# Altium project Trap_PCB_V3.3.PrjPcb
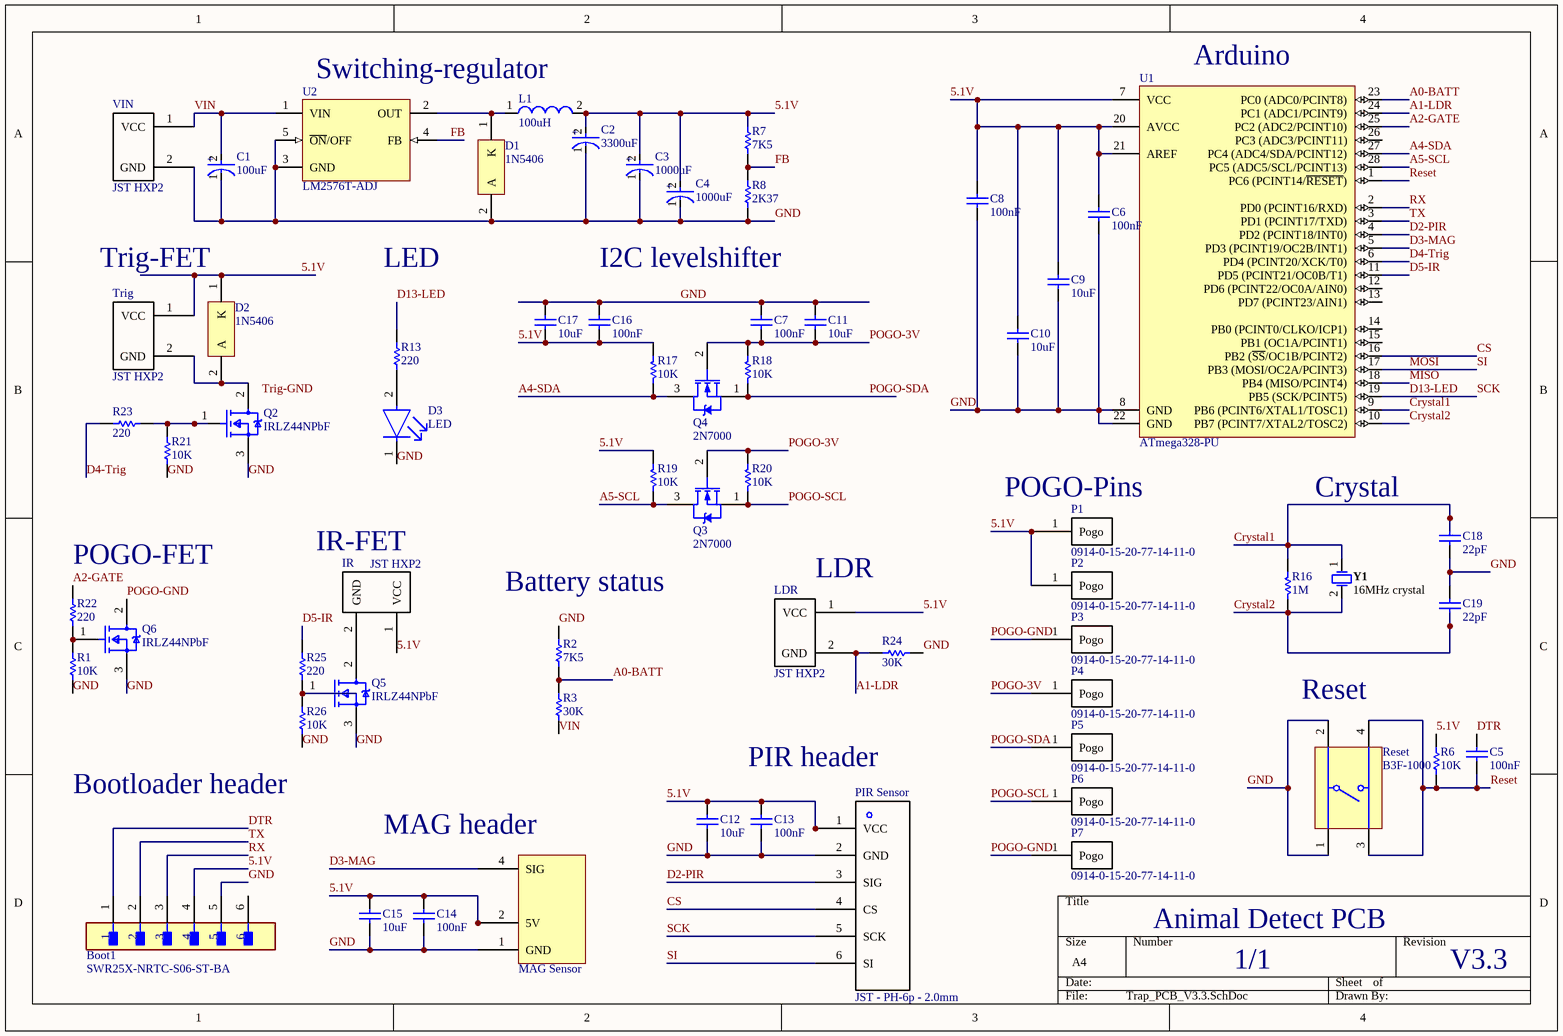
[diagram p0: Trap_PCB_V3.3.SchDoc]
1 sheet, 64 parts. Net scope: global (net labels, ports and power ports of the same name join across sheets).
Board file: Trap_PCB_V3.3.pcbdoc

## Sheet Trap_PCB_V3.3.SchDoc
size A4; SheetNumber: 1; SheetTotal: 1

### Parts
*?  MAG Sensor  [MAG]
Boot1  SWR25X-NRTC-S06-ST-BA  [FP-SWR25X-NRTC-S06-ST-BA-MFG]
C1  100uF  [FP-EEU-FR1H101B-MFG]
C2  3300uF  [FP-RAD-TH-D_10_0_5-L_12_5-MFG]
C3  1000uF  [FP-RAD-TH-D_10_0_5-L_12_5-MFG]
C4  1000uF  [FP-RAD-TH-D_10_0_5-L_12_5-MFG]
C5  100nF  [KEMT-C315-THT-2]
C6  100nF  [KEMT-C315-THT-2]
C7  100nF  [KEMT-C315-THT-2]
C8  100nF  [KEMT-C315-THT-2]
C9  10uF  [KEMT-C315-THT-2]
C10  10uF  [KEMT-C315-THT-2]
C11  10uF  [KEMT-C315-THT-2]
C12  10uF  [KEMT-C315-THT-2]
C13  100nF  [KEMT-C315-THT-2]
C14  100nF  [KEMT-C315-THT-2]
C15  10uF  [KEMT-C315-THT-2]
C16  100nF  [KEMT-C315-THT-2]
C17  10uF  [KEMT-C315-THT-2]
C18  22pF  [KEMT-C315-THT-2]
C19  22pF  [KEMT-C315-THT-2]
D1  1N5406  [ONSC-AXIAL_LEAD-2-267-05_V]
D2  1N5406  [ONSC-AXIAL_LEAD-2-267-05_V]
D3  LED  [FP-HLMP-1719-MFG]
IR  JST HXP2  [JST_XHP2_ThroughHole]
L1  100uH  [WE-TI-LB]
LDR  JST HXP2  [JST_XHP2_ThroughHole]
P1  0914-0-15-20-77-14-11-0  [0914-0-15-20-77-14-11-0]
P2  0914-0-15-20-77-14-11-0  [0914-0-15-20-77-14-11-0]
P3  0914-0-15-20-77-14-11-0  [0914-0-15-20-77-14-11-0]
P4  0914-0-15-20-77-14-11-0  [0914-0-15-20-77-14-11-0]
P5  0914-0-15-20-77-14-11-0  [0914-0-15-20-77-14-11-0]
P6  0914-0-15-20-77-14-11-0  [0914-0-15-20-77-14-11-0]
P7  0914-0-15-20-77-14-11-0  [0914-0-15-20-77-14-11-0]
PIR_Sensor  JST - PH-6p - 2.0mm  [PIR]
Q2  IRLZ44NPbF  [FP-PG-TO220-3-MFG]
Q3  2N7000  [ONSC-TO-92-3-29-11]
Q4  2N7000  [ONSC-TO-92-3-29-11]
Q5  IRLZ44NPbF  [FP-PG-TO220-3-MFG]
Q6  IRLZ44NPbF  [FP-PG-TO220-3-MFG]
R1  10K  [OMTE-RES7X2.5-2]
R2  7K5  [OMTE-RES7X2.5-2]
R3  30K  [OMTE-RES7X2.5-2]
R6  10K  [OMTE-RES7X2.5-2]
R7  7K5  [OMTE-RES7X2.5-2]
R8  2K37  [OMTE-RES7X2.5-2]
R13  220  [OMTE-RES7X2.5-2]
R16  1M  [OMTE-RES7X2.5-2]
R17  10K  [OMTE-RES7X2.5-2]
R18  10K  [OMTE-RES7X2.5-2]
R19  10K  [OMTE-RES7X2.5-2]
R20  10K  [OMTE-RES7X2.5-2]
R21  10K  [OMTE-RES7X2.5-2]
R22  220  [OMTE-RES7X2.5-2]
R23  220  [OMTE-RES7X2.5-2]
R24  30K  [OMTE-RES7X2.5-2]
R25  220  [OMTE-RES7X2.5-2]
R26  10K  [OMTE-RES7X2.5-2]
Reset  B3F-1000  [OMRON-B3F-1000-4_V]
Trig  JST HXP2  [JST_XHP2_ThroughHole]
U1  ATmega328-PU  [28P3]
U2  LM2576T-ADJ  [KC0005A]
VIN  JST HXP2  [JST_XHP2_ThroughHole]
Y1  16MHz crystal  [FOX-FOXSLF160-20]

### Nets
5.1V: *?.2(5V) Boot1.4 C2.2(A) C3.2(A) C4.2(A) C6.2 C8.2 C9.2 C10.2 C12.2 C13.2 C14.2 C15.2 C16.1 C17.1 D2.1(K) IR.1(VCC) L1.2 LDR.1(VCC) P1.1(Pogo) P2.1(Pogo) PIR_Sensor.1(VCC) R6.1 R7.2 R17.2 R19.2 Trig.1(VCC) U1.7(VCC) U1.20(AVCC) U1.21(AREF)
A0-BATT: R2.1 R3.2 U1.23(PC0_(ADC0/PCINT8))
A1-LDR: LDR.2(GND) R24.2 U1.24(PC1_(ADC1/PCINT9))
A2-GATE: R22.2 U1.25(PC2_(ADC2/PCINT10))
A4-SDA: Q4.3(D) R17.1 U1.27(PC4_(ADC4/SDA/PCINT12))
A5-SCL: Q3.3(D) R19.1 U1.28(PC5_(ADC5/SCL/PCINT13))
Crystal1: C18.2 R16.2 U1.9(PB6_(PCINT6/XTAL1/TOSC1)) Y1.1
Crystal2: C19.1 R16.1 U1.10(PB7_(PCINT7/XTAL2/TOSC2)) Y1.2
CS: PIR_Sensor.4(CS) U1.16(PB2_(~{SS}/OC1B/PCINT2))
D2-PIR: PIR_Sensor.3(SIG) U1.4(PD2_(PCINT18/INT0))
D3-MAG: *?.4(SIG) U1.5(PD3_(PCINT19/OC2B/INT1))
D4-Trig: R23.2 U1.6(PD4_(PCINT20/XCK/T0))
D5-IR: R25.2 U1.11(PD5_(PCINT21/OC0B/T1))
D13-LED: PIR_Sensor.5(SCK) R13.2 U1.19(PB5_(SCK/PCINT5))  [also labelled SCK]
DTR: Boot1.1 C5.2
FB: R7.1 R8.2 U2.4(FB)
GND: *?.1(GND) Boot1.5 C1.1(C) C2.1(C) C3.1(C) C4.1(C) C6.1 C7.2 C8.1 C9.1 C10.1 C11.2 C12.1 C13.1 C14.1 C15.1 C16.2 C17.2 C18.1 C19.2 D1.2(A) D3.1(C) PIR_Sensor.2(GND) Q2.3(S) Q5.3(S) Q6.3(S) R1.1 R2.2 R8.1 R21.1 R24.1 R26.1 Reset.1 Reset.2 U1.8(GND) U1.22(GND) U2.3(GND) U2.5(~{ON}/OFF) VIN.2(GND)
MISO: U1.18(PB4_(MISO/PCINT4))
MOSI: PIR_Sensor.6(SI) U1.17(PB3_(MOSI/OC2A/PCINT3))  [also labelled SI]
POGO-3V: C7.1 C11.1 P4.1(Pogo) Q3.2(G) Q4.2(G) R18.2 R20.2
POGO-GND: P3.1(Pogo) P7.1(Pogo) Q6.2(D)
POGO-SCL: P6.1(Pogo) Q3.1(S) R20.1
POGO-SDA: P5.1(Pogo) Q4.1(S) R18.1
Reset: C5.1 R6.2 Reset.3 Reset.4 U1.1(PC6_(PCINT14/~{RESET}))
RX: Boot1.3 U1.2(PD0_(PCINT16/RXD))
TX: Boot1.2 U1.3(PD1_(PCINT17/TXD))
VIN: C1.2(A) R3.1 U2.1(VIN) VIN.1(VCC)
NetD1_1: D1.1(K) L1.1 U2.2(OUT)
NetD2_2: D2.2(A) Q2.2(D) Trig.2(GND)
NetD3_2: D3.2(A) R13.1
NetIR_2: IR.2(GND) Q5.2(D)
NetQ2_1: Q2.1(G) R21.2 R23.1
NetQ5_1: Q5.1(G) R25.1 R26.2
NetQ6_1: Q6.1(G) R1.2 R22.1

Not connected (* = marked no-connect by the designer): Boot1 6; U1 12(PD6_(PCINT22/OC0A/AIN0)) 13(PD7_(PCINT23/AIN1)) 14(PB0_(PCINT0/CLKO/ICP1)) 15(PB1_(OC1A/PCINT1)) 26(PC3_(ADC3/PCINT11))

### Notes on the sheet
- Switching-regulator
- (near U1) Arduino
- Trig-FET
- LED
- I2C levelshifter
- (near P1) POGO-Pins
- Crystal
- (near R22) POGO-FET
- IR-FET
- (near LDR) LDR
- Battery status
- (near Reset) Reset
- PIR header
- (near R26) Bootloader header
- (near *?) MAG header
- Animal Detect PCB
- 1/1
- V3.3
- Labels drawn without touching a wire or pin: Trig-GND
- (in symbol CMP-05427-000020-1) +
- (in symbol CMP-05427-001280-1) +

### Library data of the parts
Boot1 = CMP-25680-000010-1: CONN HEADER VERT 6POS 2.54MM; Manufacturer: Sullins; Conn Orientation: Straight; Current Rating: 3A; Number Of Contacts: 6; Voltage Rating: 250V; Conn Gender: Male; Temperature Range High: +85°C; Number Of Rows: 1; ComponentLink2URL: https://drawings-pdf.s3.amazonaws.com/11633.pdf; Octopart: https://octopart.com/swr25x-nrtc-s06-st-ba-sullins-20912730; RoHS: TRUE; Lead Free: Yes; Digikey Description: CONN HEADER VERT 6POS 2.54MM; Temperature: -25°C to +85°C; ComponentLink2Description: Datasheet; Category: Conn; Device Class L1: Connectors; Package: SWR25X-NRTC-S06-ST-BA; Pitch: 2.54mm; Manufacturer Part Number: SWR25X-NRTC-S06-ST-BA; Device Class L3: unset; Automotive: No; Device Class L2: Headers and Wire Housings; Temperature Range Low: -25°C; Contact Material: Tin,Nickel; Height: 11.7mm
C1 = CMP-05427-000020-1: CAP ALUM 100UF 20% 50V RADIAL; Life (Hours): 6000Hour; Ripple Current: 870mA; Lead Diameter: 0.6mm; Impedance: 61mR; Tolerance: 20%; Mount: Through Hole; Lead Free: Lead Free; Length: 11.5mm; Height - Seated (Max): 0.512inch; Contact Plating: Tin; Termination: Radial; Series: FR; Max Operating Temperature: 105°C; Features: General Purpose; Min Operating Temperature: -40°C; RoHS Compliant: Yes; Height: 11.5mm; Voltage Rating (DC): 50V; Diameter: 8mm; Capacitance: 100uF; Lead Pitch: 5mm; Radiation Hardening: No; Package Quantity: 1; Case/Package: Radial; Voltage Rating: 50V; Packaging: Tape and Reel; ESR (Equivalent Series Resistance): 61mR; REACH SVHC: No SVHC
C2-C4 = CMP-05427-001280-1: Aluminum Electrolytic Capacitors (Radial Lead Type) AEC-Q200 Qualified 1000uF ±20% 6.3V; Ripple Current (AC): 755mA; Life (Hours): 3000Hour; Impedance: 90mR; Dielectric Material: Aluminium; Polarity: Polar; Leakage Current: 3uA; Capacitance: 1mF; Lead Diameter: 0.6mm; Voltage: 6.3V; Size: 12.5mm; Package Quantity: 200; Height - Seated (Max): 0.492inch; Ratings: AEC-Q200; Voltage Rating (DC): 6.3V; Lead Free: Lead Free; Min Operating Temperature: -55°C; Series: FC; Ripple Current: 755mA; Packaging: Bulk; Height: 12.5mm; Voltage Rating: 6.3V; Termination: Radial; Mount: Through Hole; Lead Pitch: 5mm; REACH SVHC: No SVHC; ESR (Equivalent Series Resistance): 90mR; RoHS Compliant: Yes; Contact Plating: Tin; Number of Pins: 2; Tolerance: 20%; Case/Package: Radial; Length: 12.5mm; Diameter: 10mm; Construction: RADIAL; Radiation Hardening: No; Max Operating Temperature: 105°C
C5-C19 = CMP-1664-00008-1: Capacitor, Ceramic, 22 pF, +/-10 %, 100 V, -55 to 125 degC, 2-Pin THD, RoHS, Bulk; Max Input Voltage: 40 V; Min Input Voltage: 4.2 V; Output Current: 1.5 A; Output Voltage: 1.2 V; Outputs: 1; Case\Package: TO-220; RoHSCompliant: true; Min Operating Temperature: 0 degC; Max Operating Temperature: 125 degC; Package Quantity: 50; ComponentLink2URL: http://capacitoredge.kemet.com/capedge2/DataSheet/Datasheet-C315C220K1G5TA.pdf?pn=C315C220K1G5TA{BULK}; Radiation Hardening: No; Pins: 3; Length: 10.28 mm; ComponentLink1URL: http://www.kemet.com/; ComponentLink2Description: Datasheet; Height: 9.28 mm; REACH SVHC: No SVHC; ComponentLink1Description: Manufacturer URL; Max Ouput Current: 1.5 A; Weight: 0.08113 oz; Packaging: Rail/Tube; DatasheetVersion: Aug-16; Mount: Through Hole; PackageReference: C315-THT-2; Width: 4.82 mm; PackageDescription: 2-Pin Through Hole Device, Body 3.81 x 2.54 mm
D1 D2 = CMP-0902-00090-1: Standard Recovery Rectifier, 2-Pin Axial_Lead, Pb-Free, Bulk Box; Manufacturer: On Semiconductor; IFSM Max (A): 200; IO(rec) Max (A): 3; VRRM Max (V): 600; PackageDescription: 2-Pin, Axial Lead, Diameter 5.05 mm; ComponentLink1Description: Manufacturer URL; ComponentLink3URL: http://www.onsemi.com/pub_link/Collateral/267-05.PDF; ComponentLink1URL: http://www.onsemi.com/; Mounting Technology: Through Hole; Type: Standard Recovery; DatasheetVersion: Rev. 10; ComponentLink3Description: Package Specification; Packing: Bulk Box; PackageReference: AXIAL_LEAD-2-267-05; PartNumber: 1N5406; ComponentLink2URL: http://www.onsemi.com/pub_link/Collateral/1N5400-D.PDF; PackageVersion: Rev. G, 06/2000; RoHS: TRUE; ComponentLink2Description: Datasheet
D3 = CMP-2000-06410-2: LED YELLOW DIFFUSED T-1 T/H; Manufacturer: Broadcom; Wavelength: 585nm; Led Orientation: Straight; Luminous Intensity: 2.1mcd; Forward Voltage: 1.8V; Viewing Angle: 50°; Reverse Voltage: 5V; Power Dissipation: 17.5mW; Forward Current: 2mA; Lead Free: Yes; Automotive: No; Device Class L1: Optoelectronics; Mouser Description: Standard LEDs - Through Hole Yellow Diffused 585nm 2.1mcd; Digikey Description: LED YELLOW DIFFUSED T-1 T/H; Temperature: -40°C to +100°C; Temperature Range High: +100°C; Package: 0; Category: Diode; Colour: Yellow; Device Class L2: LEDs; ComponentLink2Description: Datasheet; ComponentLink2URL: https://docs.broadcom.com/docs/AV02-1557EN; Temperature Range Low: -40°C; Device Class L3: unset; Octopart: https://octopart.com/hlmp-1719-broadcom-71130405; RoHS: TRUE; Manufacturer Part Number: HLMP-1719
L1 = CMP-0225-00065-1: Radial Leaded Wire Wound Inductor WE-TI, L = 100 µH; Inductance: 100 ÂµH; ComponentLink2URL: http://www.we-online.de/katalog/media/pdf/744743101.pdf; ComponentLink2Description: Datasheet; PackageReference: WE-TI-LB; ComponentLink1Description: Manufacturer Link; PackageDescription: THT Inductor, 2-Leads, Body 8.0 x 8.0 mm; PackageVersion: 2004; ComponentLink1URL: http://www.we-online.com; DatasheetVersion: ver 3, Nov-2004
P1-P7 = 0914-0-15-20-77-14-11-0: CONTACT SPRING LOADED T/H GOLD
Q2 Q5 Q6 = CMP-32901-000488-1: MOSFET N-CH 55V 47A TO220AB; Turn-On Delay Time: 11ns; Gate to Source Voltage (Vgs): 16V; Element Configuration: Single; Rds On Max: 22mR; Turn-Off Delay Time: 26ns; Max Power Dissipation: 110W; Threshold Voltage: 2V; Drain to Source Resistance: 35mR; Input Capacitance: 1.7nF; Continuous Drain Current (ID): 47A; Case/Package: TO-220; Lead Free: Lead Free; Halogen Free: Halogen Free; Packaging: Rail/Tube; Length: 0.414inch; Min Operating Temperature: -55°C; REACH SVHC: No SVHC; Number of Pins: 3; Width: 0.185inch; Drain to Source Voltage (Vdss): 55V; Power Dissipation: 110W; RoHS Compliant: Yes; Max Operating Temperature: 175°C; Height: 0.6inch; Max Dual Supply Voltage: 55V; Drain to Source Breakdown Voltage: 55V; Mount: Through Hole
Q3 Q4 = CMP-1058-00936-1: Small Signal MOSFET, 200 mA, 60 V, N-Channel, 3-Pin TO-92, Bulk Box; Manufacturer: On Semiconductor; Ciss Typ (pF): 60; VGS(th) Max (V): 3; Crss Typ (pF): 5; Channel Polarity: N Channel; VGS Max (V): 20; Configuration: Single; PD Max (W): 0.35; Coss Typ (pF): 25; ID Max (A): 0.2; PackageVersion: Rev. AM; ComponentLink3URL: http://www.onsemi.cn/pub_link/Collateral/2N6426-D.PDF; ComponentLink2URL: http://www.onsemi.com/pub_link/Collateral/2N7000-D.PDF; DatasheetVersion: Rev. 8; Mounting Technology: Through Hole; V(BR)DSS Min (V): 60; PartNumber: 2N7000; PackageDescription: 3-Pin Transistor Outline, Body 4.825 x 3.685 mm, Pitch 1.27 mm; ComponentLink2Description: Datasheet; ComponentLink1URL: http://www.onsemi.com/; PackageReference: TO-92-3-29-11_AM_SL; Packing: Bulk Box; ComponentLink1Description: Manufacturer URL; Package Type: TO-92; ComponentLink3Description: Package Specification
R1 R6 R17-R21 R26 = CMP-2000-06865-1: Little Demon(R) Carbon Composition Molded OD Series, 250 V, 10 KOhm, +/-5%, -70 to 130 degC, 2-Pin THD, RoHS, Bulk; PartNumber: OD103JE; Manufacturer: Ohmite; Power Rating: 0.25W; Power (Watts): 0.25W,1/4W; Tolerance: ±5%; Online Catalog: OD,OF,OASeries,LittleDemon®; Catalog Drawings: OD,OF,OASeries; EDA / CAD Models: DownloadfromAcceleratedDesigns; Mounting Technology: ThroughHole; Datasheet Version: 06/2016; RoHS Information: LittleDemon"E"SeriesMaterialDeclaration; Number of Terminations: 2; Temperature Coefficient: -; Height: -; Resistance (Ohms): 10k; Composition: CarbonComposition; Package Description: 2-Pin THD Resistor, Body 7 x 2.5 mm, Lead Dia. 0.6 mm; Size / Dimension: 0.098"Diax0.276"L(2.50mmx7.00mm); Category: Resistors; Manufacturer URL: http://www.ohmite.com/; Features: PulseWithstanding; Family: ThroughHoleResistors; Supplier Device Package: Axial; Package / Case: Axial; Standard Package: 100; Package Reference: RES7X2.5; Operating Temperature: -; Series: LittleDemon®OD; Datasheet URL: http://www.ohmite.com/cat/res_od_of_oa.pdf; Packaging: Bulk
R2 R3 R7 R8 R13 R16 R22-R25 = CMP-2000-06865-1: Little Demon(R) Carbon Composition Molded OD Series, 250 V, 10 KOhm, +/-5%, -70 to 130 degC, 2-Pin THD, RoHS, Bulk; PartNumber: OD103JE; Manufacturer: Ohmite; Resistance (Ohms): 10k; Power Rating: 0.25W; Power (Watts): 0.25W,1/4W; Tolerance: ±5%; Online Catalog: OD,OF,OASeries,LittleDemon®; Catalog Drawings: OD,OF,OASeries; EDA / CAD Models: DownloadfromAcceleratedDesigns; Mounting Technology: ThroughHole; Datasheet Version: 06/2016; RoHS Information: LittleDemon"E"SeriesMaterialDeclaration; Number of Terminations: 2; Temperature Coefficient: -; Height: -; Composition: CarbonComposition; Package Description: 2-Pin THD Resistor, Body 7 x 2.5 mm, Lead Dia. 0.6 mm; Size / Dimension: 0.098"Diax0.276"L(2.50mmx7.00mm); Category: Resistors; Manufacturer URL: http://www.ohmite.com/; Features: PulseWithstanding; Family: ThroughHoleResistors; Supplier Device Package: Axial; Package / Case: Axial; Standard Package: 100; Package Reference: RES7X2.5; Operating Temperature: -; Series: LittleDemon®OD; Datasheet URL: http://www.ohmite.com/cat/res_od_of_oa.pdf; Packaging: Bulk
Reset = CMP-1677-00002-1: Tactile Switch, SPST-NO, 0.05 A, 5 to 24 V, -25 to 70 degC, 4-Pin THD, RoHS, Bulk; Shielding: Shielded; Gender: Female; Capacitance: -45 f; Voltage Rating: 150 V; Current Rating: 1.5 A; Radiation Hardening: No; Contact Plating: Gold; Height: 14.99 mm; Min Operating Temperature: -40 degC; Packaging: Tray; ComponentLink2Description: Datasheet; ComponentLink1URL: http://www.omron.com/; Lead Pitch: 1.27 mm; RoHSCompliant: true; Pins: 8; PackageReference: B3F-1000; Width: 25.4 mm; Contact Material: Brass; ComponentLink2URL: http://www.omron.com/ecb/products/pdf/en-b3f.pdf; PackageDescription: 4-Pin Through Hole Device, Body 6 x 6 mm; DatasheetVersion: Jan-15; ComponentLink1Description: Manufacturer URL; Package Quantity: 1080; Mount: Through Hole; Length: 18.34 mm; Max Operating Temperature: 70 degC
U1 = CMP-0095-00015-2: 8-bit AVR Microcontroller, 32KB Flash, 1KB EEPROM, 2KB SRAM, 28-pin PDIP, Industrial Grade (-40°C to 85°C); ComponentLink3Description: ATmega48A/48PA/88A/88PA/168A/168PA/328/328P Summary; RevisionNote: DatasheetVersion updated. URLs added.; DatasheetVersion: revD, May-2011; ComponentLink1URL: http://www.atmel.com/; PackageVersion: revB, Sep-2001; PackageDescription: 28-lead (0.300"/7.62mm Wide) Plastic Dual Inline Package (PDIP); PackageReference: 28P3; ComponentLink1Description: Manufacturer URL; ComponentLink2Description: ATmega48A/48PA/88A/88PA/168A/168PA/328/328P Datasheet; ComponentLink3URL: http://www.atmel.com/dyn/resources/prod_documents/8271S.pdf; ComponentLink2URL: http://www.atmel.com/dyn/resources/prod_documents/8271.pdf
U2 = CMP-0069-02003-3: SIMPLE SWITCHER® 3A Step-Down Voltage Regulator, 5-pin TO-220; Manufacturer: Texas Instruments; PowerWise: N; PackageTopMarking: NSUZXYTTE#*LM2576T*-ADJ P+; PinCount: 5; RoHS: N; CompType: Switcher; Code_JEDEC: TO-220-AB; ComponentLink1URL: http://www.ti.com/general/docs/lit/getliterature.tsp?genericPartNumber=LM2576&fileType=pdf; PackageDescription: TO-220, Molded, 5 Lead, Straight; ComponentLink1Description: Datasheet URL; PackageReference: KC0005A
Y1 = CMP-1749-00003-1: Resistance Weld Thru-Hole Crystal, 16 MHz, -20 to 70 degC, 2-Pin THD, RoHS, Bulk; Voltage Rating: 250 V; Tolerance: 1%; Resistance: 221 kohm; Case\Package: Axial; Power Rating: 250 mW; RoHSCompliant: true; Package Quantity: 200; Packaging: Bulk; Min Operating Temperature: -55 degC; DatasheetVersion: Mar-15; ComponentLink1URL: http://www.foxonline.com/; Max Operating Temperature: 155 degC; PackageReference: FOXSLF160-20; Mount: Through Hole; PackageDescription: 2-Pin Through Hole Device, Body 11.35 x 4.65 mm; ComponentLink1Description: Manufacturer URL; ComponentLink2URL: http://www.foxonline.com/pdfs/hc49slf.pdf; ComponentLink2Description: Datasheet; Length: 0.248 inch